# Altium schematic sheet JTAG Interface.SchDoc: Universal JTAG Interface Rev 1.11
size A; Organization: Altium Limited; Address1: L3, 12a Rodborough Rd; Address2: Frenchs Forest; Address3: NSW; Address4: Australia 2086; DocumentNumber: 2; SheetNumber: 2; SheetTotal: 2
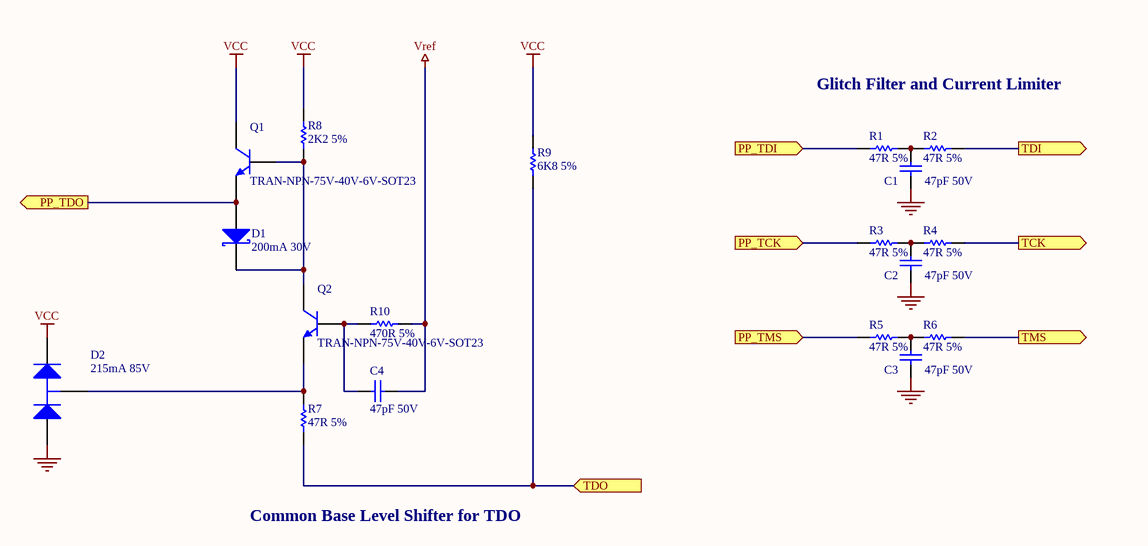
[diagram p0: JTAG Interface.SchDoc]

## Parts
C1  47pF 50V  [CAPC2012]
C2  47pF 50V  [CAPC2012]
C3  47pF 50V  [CAPC2012]
C4  47pF 50V  [CAPC2012]
D1  200mA 30V  [SOT95P230-3]
D2  215mA 85V  [SOT95P230-3]
Q1  TRAN-NPN-75V-40V-6V-SOT23  [SOT95P230-3]
Q2  TRAN-NPN-75V-40V-6V-SOT23  [SOT95P230-3]
R1  47R 5%  [RESC2012]
R2  47R 5%  [RESC2012]
R3  47R 5%  [RESC2012]
R4  47R 5%  [RESC2012]
R5  47R 5%  [RESC2012]
R6  47R 5%  [RESC2012]
R7  47R 5%  [RESC2012]
R8  2K2 5%  [RESC2012]
R9  6K8 5%  [RESC2012]
R10  470R 5%  [RESC2012]

## Ports
PP_TCK (in), PP_TDI (in), PP_TDO (out), PP_TMS (in), TCK (out), TDI (out), TDO (in), TMS (out)

## Nets
GND: C1.2 C2.2 C3.2 D2.1(A)
VCC: D2.2(K) Q1.3(C) R8.2 R9.2
Vref: C4.2 R10.1
PP_TCK: R3.1 ; port PP_TCK
PP_TDI: R1.1 ; port PP_TDI
PP_TDO: D1.1(A) Q1.2(E) ; port PP_TDO
PP_TMS: R5.1 ; port PP_TMS
TCK: R4.2 ; port TCK
TDI: R2.2 ; port TDI
TDO: R7.1 R9.1 ; port TDO
TMS: R6.2 ; port TMS
NetC1_1: C1.1 R1.2 R2.1
NetC2_1: C2.1 R3.2 R4.1
NetC3_1: C3.1 R5.2 R6.1
NetC4_1: C4.1 Q2.1(B) R10.2
NetD1_3: D1.3(k) Q1.1(B) Q2.3(C) R8.1
NetD2_3: D2.3(C) Q2.2(E) R7.2

Not connected (* = marked no-connect by the designer): D1 2

## Notes on the sheet
- Glitch Filter and Current Limiter
- Common Base Level Shifter for TDO
- Title
- Size:
- Date:
- A
- Number:
- Time:
- Revision:
- Sheet
- of
- File:

## Library data of the parts
C1-C4 = CAP-NP: Capacitor; Design Item Id: CAP-NP-47pF-50V-0805
D1 = DIO-SCHOTTKY-1S-SOT23: Schottky Barrier Single Diode; Design Item Id: DIO-SCHOTTKY-1S-SOT23
D2 = DIO-2S: Silicon Switching Diode Array for High-Speed Switching; Design Item Id: DIO-2S-215mA-85V
Q1 Q2 = TRA-NPN: General Purpose Transistor NPN Silicon; Design Item Id: TRAN-NPN-75V-40V-6V-SOT23
R1-R10 = RES: Resistor
  R1-R7: Design Item Id: RES-47R-0805
  R8: Design Item Id: RES-2K2-0805
  R9: Design Item Id: RES-6K8-0805
  R10: Design Item Id: RES-470R-0805